# Altium schematic sheet Digital Processing.SchDoc: EEG Measurement Circuit
size A2; Date: 24/01/2025; DrawnBy: Giang Phan Truong; SheetNumber: 6; SheetTotal: 7; SPICEModelCacheZPPOJSPQ: <root> / <DocumentId>ZPPOJSPQ</DocumentId> / <CacheFrame Number="0"> / <Model Name="0402_885012205086_100nf" Kind="CKT"> / <Text>******* / .subckt 0402_885012205086_100nF 1 2 / Rser 1 3 0.07 / Lser 2 4 0.00000000055 / C1 3 4 0.0000001 / Rpar 3 4 1000000000 / .ends 0402_885012205086_100nF</Text> / </Model> / <Model Name="0402_885012105012_1uf" Kind="CKT"> / <Text>******* / .subckt 0402_885012105012_1uF 1 2 / Rser 1 3 0.00986403339919 / Lser 2 4 3.2821055E-10 / C1 3 4 0.000001 / Rpar 3 4 50000000 / .ends 0402_885012105012_1uF</Text> / </Model> / <Model Name="0402_885012105008_4.7uf" Kind="CKT"> / <Text>******* / .subckt 0402_885012105008_4.7uF 1 2 / Rser 1 3 0.00453732146966 / Lser 2 4 3.78498478E-10 / C1 3 4 0.0000047 / Rpar 3 4 10000000 / .ends 0402_885012105008_4.7uF</Text> / </Model> / <Model Name="0402_885012205067_10nf" Kind="CKT"> / <Text>******* / .subckt 0402_885012205067_10nF 1 2 / Rser 1 3 0.110942181295 / Lser 2 4 1.63617133E-10 / C1 3 4 0.00000001 / Rpar 3 4 10000000000 / .ends 0402_885012205067_10nF</Text> / </Model> / </CacheFrame> / </root>
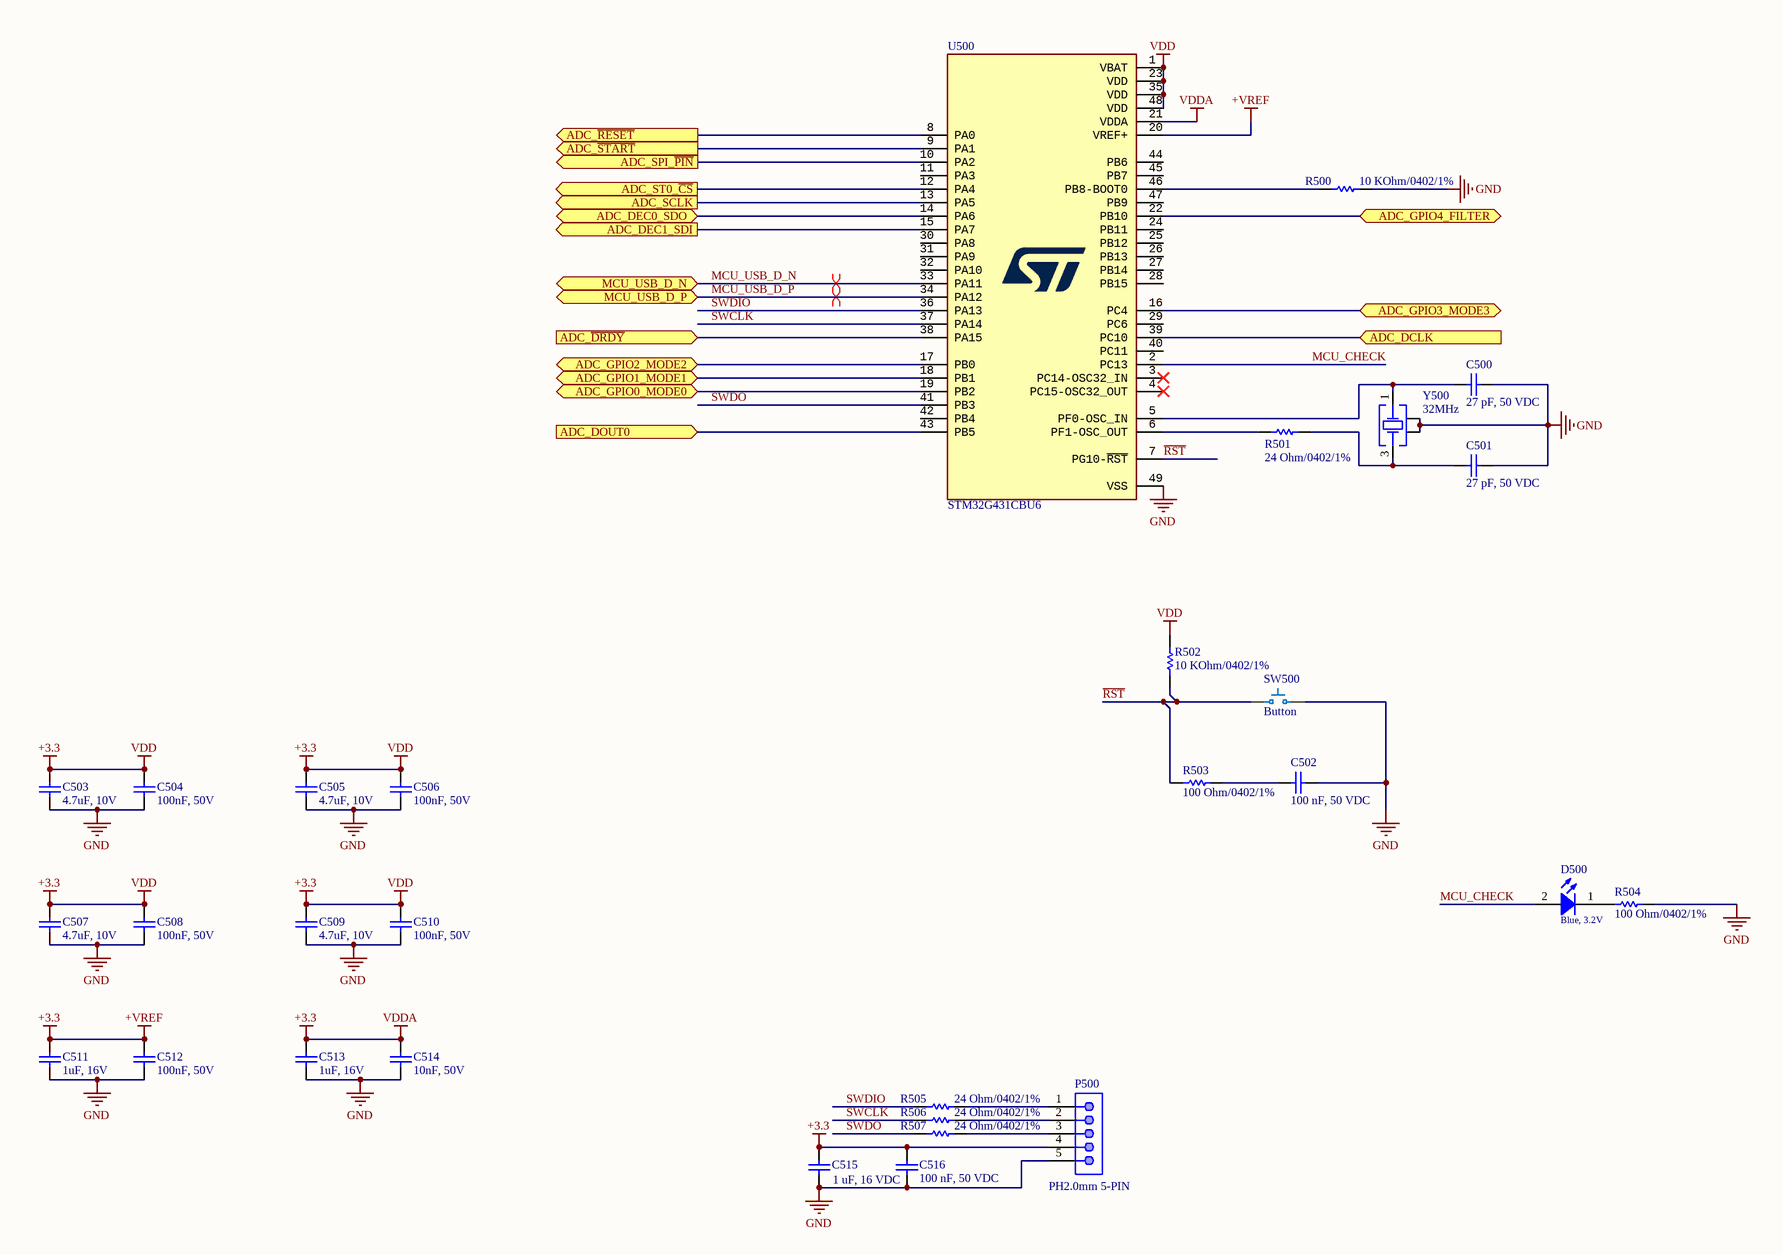
[diagram p0: Digital Processing.SchDoc]

## Parts
C500  27 pF, 50 VDC  [CAP_0603]
C501  27 pF, 50 VDC  [CAP_0603]
C502  100 nF, 50 VDC  [CAP_0603]
C503  value 4.7uF, 10V  [WCAP-CSGP_0402_L1W0.5H0.5]  (hidden comment: 4.7μF)
C504  value 100nF, 50V  [WCAP-CSGP_0402_L1W0.5H0.5]  (hidden comment: 100nF)
C505  value 4.7uF, 10V  [WCAP-CSGP_0402_L1W0.5H0.5]  (hidden comment: 4.7μF)
C506  value 100nF, 50V  [WCAP-CSGP_0402_L1W0.5H0.5]  (hidden comment: 100nF)
C507  value 4.7uF, 10V  [WCAP-CSGP_0402_L1W0.5H0.5]  (hidden comment: 4.7μF)
C508  value 100nF, 50V  [WCAP-CSGP_0402_L1W0.5H0.5]  (hidden comment: 100nF)
C509  value 4.7uF, 10V  [WCAP-CSGP_0402_L1W0.5H0.5]  (hidden comment: 4.7μF)
C510  value 100nF, 50V  [WCAP-CSGP_0402_L1W0.5H0.5]  (hidden comment: 100nF)
C511  value 1uF, 16V  [WCAP-CSGP_0402_L1W0.5H0.5]  (hidden comment: 1μF)
C512  value 100nF, 50V  [WCAP-CSGP_0402_L1W0.5H0.5]  (hidden comment: 100nF)
C513  value 1uF, 16V  [WCAP-CSGP_0402_L1W0.5H0.5]  (hidden comment: 1μF)
C514  value 10nF, 50V  [WCAP-CSGP_0402_L1W0.5H0.5]  (hidden comment: 10nF)
C515  1 uF, 16 VDC  [CAP_0603]
C516  100 nF, 50 VDC  [CAP_0603]
D500  Blue, 3.2V  [WL-SMCW_0805]
P500  PH2.0mm 5-PIN  [620105131822]
R500  value 10 KOhm/0402/1%  [R0402]  (hidden comment: Resistor 10 KOhm 0402 1%)
R501  value 24 Ohm/0402/1%  [R0402]  (hidden comment: Resistor 24 Ohm 0402 1%)
R502  value 10 KOhm/0402/1%  [R0402]  (hidden comment: Resistor 10 KOhm 0402 1%)
R503  value 100 Ohm/0402/1%  [R0402]  (hidden comment: Resistor 100 Ohm 0402 1%)
R504  value 100 Ohm/0402/1%  [R0402]  (hidden comment: Resistor 100 Ohm 0402 1%)
R505  value 24 Ohm/0402/1%  [R0402]  (hidden comment: Resistor 24 Ohm 0402 1%)
R506  value 24 Ohm/0402/1%  [R0402]  (hidden comment: Resistor 24 Ohm 0402 1%)
R507  value 24 Ohm/0402/1%  [R0402]  (hidden comment: Resistor 24 Ohm 0402 1%)
SW500  Button  [Button_3x4mm_SMD_2P]
U500  STM32G431CBU6  [QFN50P700X700X60-49N]
Y500  32MHz  [WE-XTAL_CFPX-104]

## Ports
ADC_DCLK (in, see Block Diagram[5B], ADC[6B]), ADC_DEC0_SDO (bidir, see Block Diagram[5B], ADC[6B]), ADC_DEC1_SDI (out, see Block Diagram[5B], ADC[6B]), ADC_DOUT0 (in, see Block Diagram[5B], ADC[6B]), ADC_GPIO0_MODE0 (bidir, see Block Diagram[5B], ADC[6C]), ADC_GPIO1_MODE1 (bidir, see Block Diagram[5B], ADC[6C]), ADC_GPIO2_MODE2 (bidir, see Block Diagram[5B], ADC[6C]), ADC_GPIO3_MODE3 (bidir, see Block Diagram[5B], ADC[6C]), ADC_GPIO4_FILTER (bidir, see Block Diagram[5B], ADC[6C]), ADC_SCLK (out, see Block Diagram[5B], ADC[6B]), ADC_SPI_~{PIN} (out, see Block Diagram[5B], ADC[6C]), ADC_ST0_~{CS} (out, see Block Diagram[5B], ADC[6B]), ADC_~{DRDY} (in, see Block Diagram[5B], ADC[6B]), ADC_~{RESET} (out, see Block Diagram[5B], ADC[6B]), ADC_~{START} (out, see Block Diagram[5B], ADC[5B]), MCU_USB_D_N (bidir, see Block Diagram[6B], Interface[5B]), MCU_USB_D_P (bidir, see Block Diagram[6B], Interface[5B])

## Nets
+3.3: C503.2 C504.2 C505.2 C506.2 C507.2 C508.2 C509.2 C510.2 C511.1 C512.2 C513.1 C514.2 C515.2 C516.1 P500.4 R502.1 U500.1(VBAT) U500.20(VREF+) U500.21(VDDA) U500.23(VDD) U500.35(VDD) U500.48(VDD)  [also labelled +VREF, VDD, VDDA]
GND: C500.1 C501.1 C502.2 C503.1 C504.1 C505.1 C506.1 C507.1 C508.1 C509.1 C510.1 C511.2 C512.1 C513.2 C514.1 C515.1 C516.2 P500.5 R500.2 R504.2 SW500.2 U500.49(VSS) Y500.2(GND_&_Lid) Y500.4(GND_&_Lid)
ADC_~{DRDY}: U500.38(PA15) ; port ADC_~{DRDY}
ADC_DCLK: U500.39(PC10) ; port ADC_DCLK
ADC_DEC0_SDO: U500.14(PA6) ; port ADC_DEC0_SDO
ADC_DEC1_SDI: U500.15(PA7) ; port ADC_DEC1_SDI
ADC_DOUT0: U500.43(PB5) ; port ADC_DOUT0
ADC_GPIO0_MODE0: U500.19(PB2) ; port ADC_GPIO0_MODE0
ADC_GPIO1_MODE1: U500.18(PB1) ; port ADC_GPIO1_MODE1
ADC_GPIO2_MODE2: U500.17(PB0) ; port ADC_GPIO2_MODE2
ADC_GPIO3_MODE3: U500.16(PC4) ; port ADC_GPIO3_MODE3
ADC_GPIO4_FILTER: U500.22(PB10) ; port ADC_GPIO4_FILTER
ADC_~{RESET}: U500.8(PA0) ; port ADC_~{RESET}
ADC_~{START}: U500.9(PA1) ; port ADC_~{START}
ADC_SCLK: U500.13(PA5) ; port ADC_SCLK
ADC_SPI_~{PIN}: U500.10(PA2) ; port ADC_SPI_~{PIN}
ADC_ST0_~{CS}: U500.12(PA4) ; port ADC_ST0_~{CS}
MCU_CHECK: D500.2(A) U500.2(PC13)
MCU_USB_D_N: U500.33(PA11) ; port MCU_USB_D_N
MCU_USB_D_P: U500.34(PA12) ; port MCU_USB_D_P
~{RST}: R502.2 R503.1 SW500.1 U500.7(PG10-~{RST})
SWCLK: R506.1 U500.37(PA14)
SWDIO: R505.1 U500.36(PA13)
SWDO: R507.1 U500.41(PB3)
NetC500_2: C500.2 U500.5(PF0-OSC_IN) Y500.1(Crystal)
NetC501_2: C501.2 R501.2 Y500.3(Crystal)
NetC502_1: C502.1 R503.2
NetD500_1: D500.1(K) R504.1
NetP500_1: P500.1 R505.2
NetP500_2: P500.2 R506.2
NetP500_3: P500.3 R507.2
NetR500_1: R500.1 U500.46(PB8-BOOT0)
NetR501_1: R501.1 U500.6(PF1-OSC_OUT)

Not connected (* = marked no-connect by the designer): U500 3(PC14-OSC32_IN)* 4(PC15-OSC32_OUT)* 11(PA3) 24(PB11) 25(PB12) 26(PB13) 27(PB14) 28(PB15) 29(PC6) 30(PA8) 31(PA9) 32(PA10) 40(PC11) 42(PB4) 44(PB6) 45(PB7) 47(PB9)

## Layout directives
differential pair: MCU_USB_D_N, MCU_USB_D_P

## Notes on the sheet
- Project Name:
- Date:
- Size
- Size:
- A2
- Last Modified:
- Revision:
- Drawn By:
- File:
- Checked By:
- Sheet
- of

## Library data of the parts
C500 C501 = 0106032200550: CAP, size 0603, 22 pF, 50 VDC; Manufacture Name: TDK; Manufacture SN: CGA3E2NP01H220J080AA; Tolerance: +/-5%; Voltage Rating DC: 50 VDC; Operating Temperature: -55 to +125degC; Packaging: Tape and Reel; Mounting Technology: SMT; Size: 0603; Supplier 1 Name: Mouser; Supplier 1 SN: 810-CGA3E2NP01H220JA; Supplier 1 URL: https://www.mouser.com/ProductDetail/TDK/CGA3E2NP01H220J080AA?qs=xLDY6iXSiQbIDiPJq57tVA%3D%3D&utm_source=mouser-refine-download&utm_medium=file&utm_campaign=CGA3E2NP01H220J080AA&utm_content=TDK; Supplier 2 Name: Digi-Key; Supplier 2 SN: 445-12401-2-ND; Supplier 2 URL: https://www.digikey.com/en/products/detail/tdk-corporation/cga3e2np01h220j080aa/3949637; Supplier 3 Name: thegioiic; Supplier 3 SN: N/A; Supplier 3 URL: N/A; Value: 27 pF, 50 VDC; Buy: https://tme.vn/Product.aspx?id=741#page=pro_info
C502 C516 = 0106031041050: CAP, size 0603, 100 nF, 50 VDC; Manufacture Name: TDK; Manufacture SN: CGA3E3X8R1H104K080AE; Capacitance: 100 nF; Tolerance: +/-10%; Voltage Rating DC: 50 VDC; ComponentLink2Description: Datasheet; ComponentLink2URL: https://product.tdk.com/system/files/dam/doc/product/capacitor/ceramic/mlcc/catalog/mlcc_automotive_soft_en.pdf?ref_disty=mouser; Operating Temperature: -55 to +125degC; Packaging: Tape and Reel; Mounting Technology: SMT; Size: 0603; Supplier 1 Name: Mouser; Supplier 1 SN: 810-CGA3E3X8R1H104KA; Supplier 1 URL: https://www.mouser.com/ProductDetail/TDK/CGA3E3X8R1H104K080AE?qs=nQSIdc08i%252Bd8g3IRRgU2bw%3D%3D&utm_source=mouser-refine-download&utm_medium=file&utm_campaign=CGA3E3X8R1H104K080AE&utm_content=TDK; Supplier 2 Name: Digi-Key; Supplier 2 SN: 445-173697-2-ND; Supplier 2 URL: https://www.digikey.com/en/products/detail/tdk-corporation/cga3e3x8r1h104k080ae/5809262; Supplier 3 Name: thegioiic; Supplier 3 SN: N/A; Supplier 3 URL: N/A; Value: 100 nF, 50 VDC; Buy: https://tme.vn/Product.aspx?id=739#page=pro_info
C503 C505 C507 C509 = 885012105008: WCAP-CSGP Multilayer Ceramic Chip Capacitor, General Purpose, size 0402, X5R, 4.7μF, 6.3V; Manufacturer: Wurth Elektronik; Case/Size Code: 0402; Capacitance Tolerance: +/-20%; Dissipation Factor: 20%; Insulation Resistance: 0.01GΩ; Technical Reference: X5R0402475M6R3DFCT10000; Manufacturer Part Number: 885012105008; Category: Multilayer Ceramic Chip Capacitors; Match Code: WCAP-CSGP; ComponentLink1Description: Website Link; ComponentLink1URL: https://www.we-online.com/redexpert/article/885012105008?ad; ComponentLink2Description: Datasheet Link; ComponentLink2URL: https://www.we-online.com/redexpert/spec/885012105008?ad; Mount: Surface Mount; Min Operating Temperature: -55°C; Max Operating Temperature: 85°C; Packaging: Tape and Reel; Length: 1mm; Width: 0.5mm; Height: 0.5mm; Capacitance: 4.7μF; Ceramic Type: X5R; Rated Voltage (DC): 6.3V; Buy: https://www.digikey.com/en/products/detail/samsung-electro-mechanics/CL05A475MP5NRNC/3887140
C504 C506 C508 C510 C512 = 885012205086: WCAP-CSGP Multilayer Ceramic Chip Capacitor, General Purpose, size 0402, X7R, 100nF, 50V; Manufacturer: Wurth Elektronik; Case/Size Code: 0402; Capacitance Tolerance: +/-10%; Dissipation Factor: 10%; Insulation Resistance: 0.5GΩ; Technical Reference: X7R0402104K050DFCT10000; Buy: tme.vn/Product.aspx?id=1812#page=pro_info; Manufacturer Part Number: 885012205086; Category: Multilayer Ceramic Chip Capacitors; Match Code: WCAP-CSGP; ComponentLink1Description: Website Link; ComponentLink1URL: https://www.we-online.com/redexpert/article/885012205086?ad; ComponentLink2Description: Datasheet Link; ComponentLink2URL: https://www.we-online.com/redexpert/spec/885012205086?ad; Mount: Surface Mount; Min Operating Temperature: -55°C; Max Operating Temperature: 125°C; Packaging: Tape and Reel; Length: 1mm; Width: 0.5mm; Height: 0.5mm; Capacitance: 100nF; Ceramic Type: X7R; Rated Voltage (DC): 50V
C511 C513 = 885012105012: 1 µF ±10% 16V Ceramic Capacitor X7R 0603 (1608 Metric); Manufacturer: Wurth Elektronik; Match Code: WCAP-CSGP; Case/Size Code: 0402; Capacitance Tolerance: +/-20%; Ceramic Type: X5R; Dissipation Factor: 15%; Insulation Resistance: 0.05GΩ; Rated Voltage (DC): 10V; Technical Reference: X5R0402105M010DFCT10000; Manufacturer Part Number: 885012105012; Category: Multilayer Ceramic Chip Capacitors; ComponentLink1Description: Website Link; ComponentLink1URL: https://www.we-online.com/redexpert/article/885012105012?ad; ComponentLink2Description: Datasheet Link; ComponentLink2URL: https://www.we-online.com/redexpert/spec/885012105012?ad; Mount: Surface Mount; Min Operating Temperature: -55°C; Max Operating Temperature: 85°C; Packaging: Tape and Reel; Length: 1mm; Width: 0.5mm; Height: 0.5mm; Capacitance: 1μF; Buy: https://www.digikey.com/en/products/detail/kemet/C0603C105K4RACTU/2199788
C514 = 885012205067: WCAP-CSGP Multilayer Ceramic Chip Capacitor, General Purpose, size 0402, X7R, 10nF, 50V; Manufacturer: Wurth Elektronik; Case/Size Code: 0402; Capacitance Tolerance: +/-10%; Dissipation Factor: 2.5%; Insulation Resistance: 10GΩ; Technical Reference: X7R0402103K050DFCT10000; Manufacturer Part Number: 885012205067; Category: Multilayer Ceramic Chip Capacitors; Match Code: WCAP-CSGP; ComponentLink1Description: Website Link; ComponentLink1URL: https://www.we-online.com/redexpert/article/885012205067?ad; ComponentLink2Description: Datasheet Link; ComponentLink2URL: https://www.we-online.com/redexpert/spec/885012205067?ad; Mount: Surface Mount; Min Operating Temperature: -55°C; Max Operating Temperature: 125°C; Packaging: Tape and Reel; Length: 1mm; Width: 0.5mm; Height: 0.5mm; Capacitance: 10nF; Ceramic Type: X7R; Rated Voltage (DC): 50V; Buy: https://www.digikey.com/en/products/detail/kemet/C0402C103K5RACTU/501968
C515 = 0106031051016: CAP, size 0603, 1 uF, 16 VDC; Manufacture Name: Samsung Electro-Mechanics; Manufacture SN: CL10B105KO8NNWC; Capacitance: 1 uF; Tolerance: +/-10%; Voltage Rating DC: 16 VDC; Operating Temperature: -55 to +125degC; Packaging: Tape and Reel; Mounting Technology: SMT; Size: 0603; Supplier 1 Name: Mouser; Supplier 1 SN: 187-CL10B105KO8NNWC; Supplier 1 URL: https://www.mouser.vn/ProductDetail/Samsung-Electro-Mechanics/CL10B105KO8NNWC?qs=81r%252BiQLm7BT%252BXtc72qn1ug%3D%3D&utm_source=mouser-refine-download&utm_medium=file&utm_campaign=CL10B105KO8NNWC&utm_content=Samsung-Electro-Mechanics; Supplier 2 Name: Digi-Key; Supplier 2 SN: 1276-CL10B105KO8NNWCTR-ND; Supplier 2 URL: https://www.digikey.com/en/products/detail/samsung-electro-mechanics/cl10b105ko8nnwc/16572783; Supplier 3 Name: thegioiic; Supplier 3 SN: N/A; Supplier 3 URL: https://www.thegioiic.com/tu-gom-0603-1uf-16v; Value: 1 uF, 16 VDC; Buy: https://tme.vn/Product.aspx?id=728#page=pro_info
D500 = 160805BlueClear: WL-SMCW SMT Mono-color Chip LED Waterclear, size 0805, Blue, 3.2V, 140deg; Type: Clear; Color: Blue; Size: 0603; ComponentLink1Description: Datasheet link; ComponentLink1URL: N/A; ComponentLink2Description: Supplier 1 URL; ComponentLink2URL: https://www.mouser.vn/ProductDetail/Wurth-Elektronik/150080BS75000?qs=2kOmHSv6VfT2tBo3UPVqAQ%3D%3D; ComponentLink3Description: Supplier 2 URL; ComponentLink3URL: https://www.digikey.com/en/products/detail/liteon/LTST-C170TBKT/388527; ComponentLink4Description: Supplier 3 URL; ComponentLink4URL: https://www.thegioiic.com/led-xanh-duong-0805-dan-smd-trong-suot-harvatek; Supplier 1 Name: Mouser; Supplier 1 SN: 710-150080BS75000; Supplier 1 URL: https://www.mouser.vn/ProductDetail/Wurth-Elektronik/150080BS75000?qs=2kOmHSv6VfT2tBo3UPVqAQ%3D%3D; Supplier 2 Name: Digi-Key; Supplier 2 SN: 160-1579-2-ND; Supplier 2 URL: https://www.digikey.com/en/products/detail/liteon/LTST-C170TBKT/388527; Supplier 3 Name: ICDayRoi; Supplier 3 SN: N/A; Supplier 3 URL: https://www.thegioiic.com/led-xanh-duong-0805-dan-smd-trong-suot-harvatek; Value: Blue, 3.2V
P500 = 620105131822: WR-WTB SMT Male Horizontal Shrouded Header, pitch 2mm, 5p; Manufacturer: Wurth Elektronik; Pin Number: 5; Contact Resistance: 20mOhm; Rated Current: 2A; Withstanding Voltage: 800VAC; Working Voltage: 100VAC; ComponentLink1Description: Datasheet; ComponentLink1URL: https://www.we-online.com/catalog/datasheet/620105131822.pdf; Pitch: 2mm; Packaging: Tape and Reel; Part Number: 620105131822; Gender: Male; Type: Horizontal; Supplier 1 URL: https://www.mouser.vn/ProductDetail/Wurth-Elektronik/620105131822?qs=ZtY9WdtwX54F%2Fgkpjaf7GA%3D%3D; Supplier 2 URL: N/A; Supplier 3 URL: https://www.thegioiic.com/dau-ph-2-0mm-5-chan-dan-smd-nam-ngang; Value: PH2.0mm 5-PIN; LCSC Part #: N/A; Manufacturer Part Number: 620105131822; Mount: SMD/SMT; Operating Temperature Max: + 85 C; Operating Temperature Min: - 25 C; Package / Case: 5; Supplier 1: Mouser; Supplier 1 Part Number: 710-620105131822; Supplier 2: Digi-Key; Supplier 2 Part Number: N/A; Supplier 3: thegioiic; Supplier 3 Part Number: N/A
R500 R502 = Resistor 10 KOhm 0402 1%: Code 103, 1/16W 1%; ComponentLink1Description: Buy; ComponentLink1URL: https://www.thegioiic.com/dien-tro-10-kohm-0402-1-
R501 R505-R507 = Resistor 24 Ohm 0402 1%: 1/16W Thick Film Resistors 50V ±5% ±200ppm/℃ 24Ω 0402 Chip Resistor - Surface Mount ROHS; Buy: https://www.lcsc.com/product-detail/Chip-Resistor-Surface-Mount_FH-Guangdong-Fenghua-Advanced-Tech-RC-02W240JT_C258123.html?s_z=n_24%2520Ohm
R503 R504 = Resistor 100 Ohm 0402 1%: Code 104, 1/16W; ComponentLink1Description: Buy; ComponentLink1URL: https://www.thegioiic.com/dien-tro-100-ohm-0402-1-
SW500 = Button_SMD_3x4mm_2P: Supply Part Number: Tụ Gốm 0603 20pF 50V; Supply Name: Thegioiic; Datasheet: *; Supply URL: https://www.thegioiic.com/tu-gom-0603-20pf-50v
U500 = STM32G431CBU6: ARM® Cortex®-M4F STM32G4 Microcontroller IC 32-Bit Single-Core 170MHz 128KB (128K x 8) FLASH 48-UFQFPN (7x7); Buy: https://www.digikey.com/en/products/detail/stmicroelectronics/STM32G431CBU6/10231569; Value: STM32G431CBU6
Y500 = 830059535: WE-XTAL Quartz Crystal, SMT, CFPX-104, 32MHz, +/-20ppm; Manufacturer: Wurth Elektronik; Frequency Stability: +/-30ppm; Load Capacitance: 18pF; ComponentLink1Description: Website Link; ComponentLink1URL: https://www.we-online.com/redexpert/article/830059535?ad; ComponentLink2Description: Datasheet Link; ComponentLink2URL: https://www.we-online.com/redexpert/spec/830059535?ad; Manufacturer Part Number: 830059535; Category: Crystals; Match Code: WE-XTAL; Mount: Surface Mount; Operating Temperature Max: 85°C; Operating Temperature Min: -40°C; Packaging: Tape and Reel; Case/Size Code: CFPX-104; Length: 5mm; Width: 3.2mm; Height: 1mm; Frequency: 32MHz; Frequency Tolerance: +/-20ppm; Value: 32MHz